# Altium schematic sheet SWR Tandem Match.SchDoc: SWR Tandem Match
size A4; DocumentNumber: 19; Revision: 1.8.2; SheetNumber: 19; SheetTotal: 19
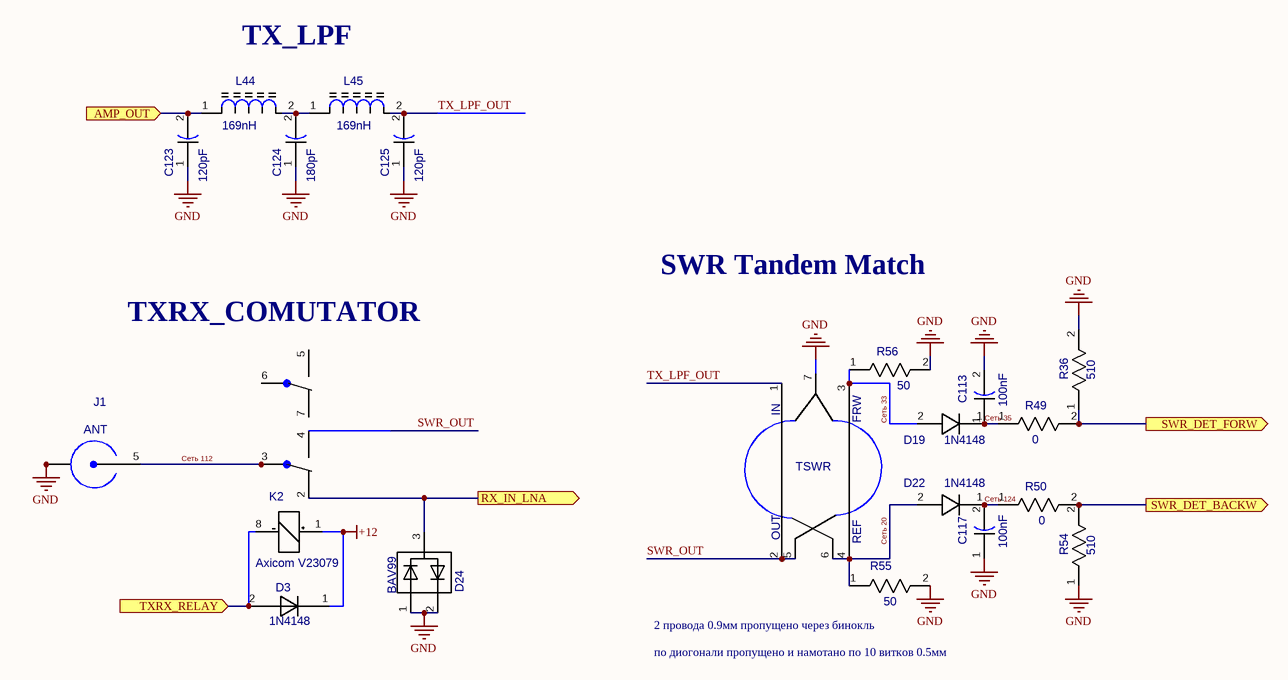
[diagram p0: SWR Tandem Match.SchDoc]

## Parts
C113  value 100nF  [CAP_0805]  (hidden comment: CAP_0805)
C117  value 100nF  [CAP_0805]  (hidden comment: CAP_0805)
C123  value 120pF  [CAP_1206]  (hidden comment: CAP_1206)
C124  value 180pF  [CAP_1206]  (hidden comment: CAP_1206)
C125  value 120pF  [CAP_1206]  (hidden comment: CAP_1206)
D3  1N4148  [1N4148]
D19  value 1N4148  [DIODE_1206]  (hidden comment: DIODE_1206)
D22  value 1N4148  [DIODE_1206]  (hidden comment: DIODE_1206)
D24  BAV99  [SOT23]
J1  value ANT  [31-5431]  (hidden comment: 31-5431)
K2  Axicom V23079  [V23079]
L44  value 169nH  [IND_FERRITE_CORE_1]  (hidden comment: IND_FERRITE_CORE)
L45  value 169nH  [IND_FERRITE_CORE_1]  (hidden comment: IND_FERRITE_CORE)
R36  value 510  [RES_0805]  (hidden comment: RES_0805)
R49  value 0  [RES_0805]  (hidden comment: RES_0805)
R50  value 0  [RES_0805]  (hidden comment: RES_0805)
R54  value 510  [RES_0805]  (hidden comment: RES_0805)
R55  value 50  [RES_1206]  (hidden comment: RES_1206)
R56  value 50  [RES_1206]  (hidden comment: RES_1206)
TSWR  SWR_TANDEM_MATCH  [SWR_TANDEM_MATCH]  (value not drawn)

## Ports
AMP_OUT (in), RX_IN_LNA (out), SWR_DET_BACKW (out), SWR_DET_FORW (out), TXRX_RELAY (in)

## Nets
+12: D3.1(K) K2.1(+)
GND: C113.2 C117.1 C123.1 C124.1 C125.1 D24.1(A(D1)) D24.2(C(D2)) J1.1(GND) J1.2(GND) J1.3(GND) J1.4(GND) R36.2 R54.1 R55.2 R56.2 TSWR.7
AMP_OUT: C123.2 L44.1(A) ; port AMP_OUT
RX_IN_LNA: D24.3(C(D1),A(D2)) K2.2(O) ; port RX_IN_LNA
SWR_DET_BACKW: R50.2 R54.2 ; port SWR_DET_BACKW
SWR_DET_FORW: R36.1 R49.2 ; port SWR_DET_FORW
SWR_OUT: K2.4(S) TSWR.2 TSWR.5
TX_LPF_OUT: C125.2 L45.2(B) TSWR.1
TXRX_RELAY: D3.2(A) K2.8(-) ; port TXRX_RELAY
Сеть 20: D22.2(A) R55.1 TSWR.4 TSWR.6
Сеть 33: D19.2(A) R56.1 TSWR.3
Сеть 35: C113.1 D19.1(K) R49.1
Сеть 112: J1.5(CON) K2.3(P)
Сеть 124: C117.2 D22.1(K) R50.1
NetC124_2: C124.2 L44.2(B) L45.1(A)

Not connected (* = marked no-connect by the designer): K2 5(S) 6(P) 7(O)

## Notes on the sheet
- TX_LPF
- SWR Tandem Match
- (near K2) TXRX_COMUTATOR
- (near R55) 2 провода 0.9мм пропущено через бинокль
- по диогонали пропущено и намотано по 10 витков 0.5мм
- Title
- Size:
- Date:
- A4
- Number:
- Time:
- Revision:
- Sheet
- of
- File:
- (in symbol SWR_TANDEM_MATCH) IN; FRW; OUT; REF

## Library data of the parts
L44 L45 = IND_FERRITE_CORE: Inductor
D3 = 1N4148: Value: 1N4148
D24 = BAV99: Value: BAV99
K2 = Axicom V23079: Value: *